# Altium schematic sheet eDP.SchDoc
size A4; SheetNumber: 3; SheetTotal: 9
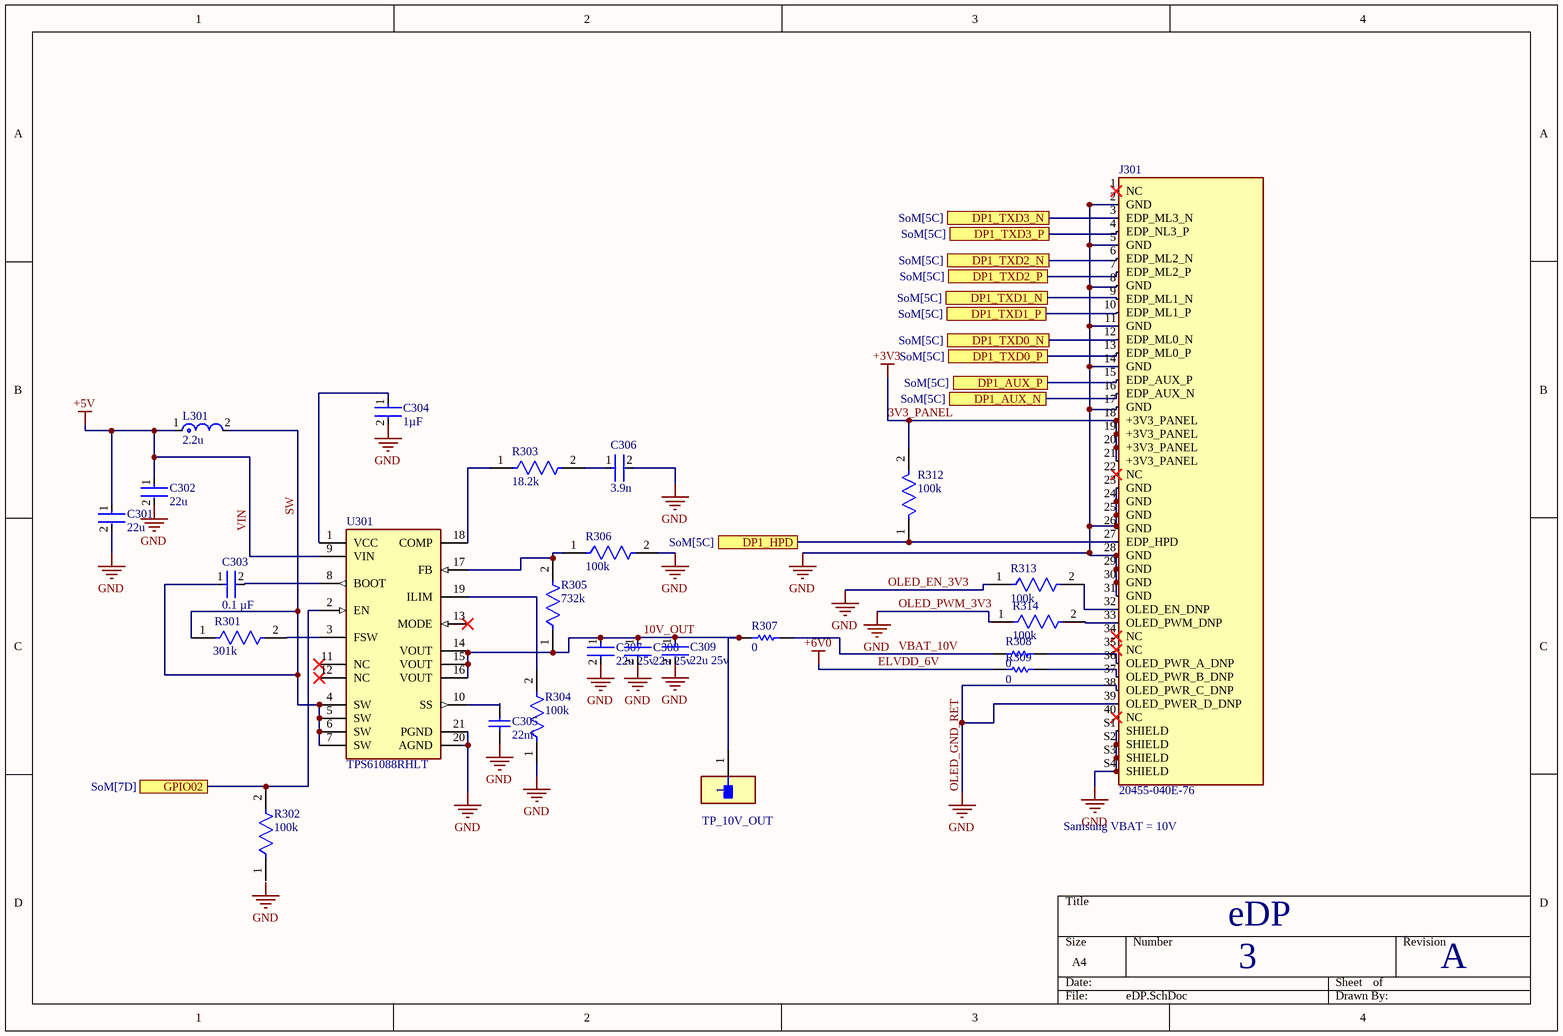
[diagram p0: eDP.SchDoc]

## Parts
C301  22u  [FP-CL10-IPC_B]
C302  22u  [FP-CL10-IPC_B]
C303  0.1 µF  [FP-GRM155-0_05-IPC_B]
C304  1µF  [FP-GRM15-0_1-MFG]
C305  22nf  [CAPC1608X90X35ML10T15]
C306  3.9n  [FP-GRM188-0_1-e0_2_0_5-IPC_B]
C307  22u 25v  [FP-GRM21B-0_2-e0_2_0_7-IPC_B]
C308  22u 25v  [FP-GRM21B-0_2-e0_2_0_7-IPC_B]
C309  22u 25v  [FP-GRM21B-0_2-e0_2_0_7-IPC_B]
J300  TP_10V_OUT  [FP-S2751-46R-MFG]
J301  20455-040E-76  [IPEX_20455-040E-76]
L301  2.2u  [FP-XAL5030-222MEC-MFG]
R301  301k  [FP-CRCW0603-e3-IPC_C]
R302  100k  [FP-CRCW0603C-e3-MFG]
R303  18.2k  [FP-CRCW0603-e3-IPC_C]
R304  100k  [FP-CRCW0603C-e3-MFG]
R305  732k  [FP-CRCW0603-e3-IPC_B]
R306  100k  [FP-CRCW0603C-e3-MFG]
R307  0  [RESC1005X40X25NL05T10]
R308  0  [RESC1005X40X25NL05T10]
R309  0  [RESC1005X40X25NL05T10]
R312  100k  [FP-RC0402-0_4-IPC_A]
R313  100k  [FP-CRCW0603C-e3-MFG]
R314  100k  [FP-CRCW0603C-e3-MFG]
U301  TPS61088RHLT  [FP-RHL0020A-MFG]

## Ports
DP1_AUX_N (see SoM[5C]), DP1_AUX_P (see SoM[5C]), DP1_HPD (see SoM[5C]), DP1_TXD0_N (see SoM[5C]), DP1_TXD0_P (see SoM[5C]), DP1_TXD1_N (see SoM[5C]), DP1_TXD1_P (see SoM[5C]), DP1_TXD2_N (see SoM[5C]), DP1_TXD2_P (see SoM[5C]), DP1_TXD3_N (see SoM[5C]), DP1_TXD3_P (see SoM[5C]), GPIO02 (see SoM[7D])

## Nets
3V3_PANEL: J301.18(+3V3_PANEL) J301.19(+3V3_PANEL) J301.20(+3V3_PANEL) J301.21(+3V3_PANEL) R312.2  [also labelled +3V3]
ELVDD_6V: R309.1  [also labelled +6V0]
OLED_EN_3V3: C301.2 C302.2 C304.2 C305.1 C306.2 C307.2 C308.2 C309.2 J301.2(GND) J301.5(GND) J301.8(GND) J301.11(GND) J301.14(GND) J301.17(GND) J301.23(GND) J301.24(GND) J301.25(GND) J301.26(GND) J301.28(GND) J301.29(GND) J301.30(GND) J301.31(GND) J301.38(OLED_PWR_C_DNP) J301.39(OLED_PWER_D_DNP) J301.S1(SHIELD) J301.S2(SHIELD) J301.S3(SHIELD) J301.S4(SHIELD) R304.1 R306.2 R313.1 R314.1 U301.20(AGND) U301.21(PGND)  [also labelled GND, OLED_GND_RET, OLED_PWM_3V3]
VIN: C301.1 C302.1 L301.1 U301.9(VIN)  [also labelled +5V]
10V_OUT: C307.1 C308.1 C309.1 J300.1 R305.1 R307.1 U301.14(VOUT) U301.15(VOUT) U301.16(VOUT)
DP1_AUX_N: J301.16(EDP_AUX_N) ; port DP1_AUX_N
DP1_AUX_P: J301.15(EDP_AUX_P) ; port DP1_AUX_P
DP1_HPD: J301.27(EDP_HPD) R312.1 ; port DP1_HPD
DP1_TXD0_N: J301.12(EDP_ML0_N) ; port DP1_TXD0_N
DP1_TXD0_P: J301.13(EDP_ML0_P) ; port DP1_TXD0_P
DP1_TXD1_N: J301.9(EDP_ML1_N) ; port DP1_TXD1_N
DP1_TXD1_P: J301.10(EDP_ML1_P) ; port DP1_TXD1_P
DP1_TXD2_N: J301.6(EDP_ML2_N) ; port DP1_TXD2_N
DP1_TXD2_P: J301.7(EDP_ML2_P) ; port DP1_TXD2_P
DP1_TXD3_N: J301.3(EDP_ML3_N) ; port DP1_TXD3_N
DP1_TXD3_P: J301.4(EDP_NL3_P) ; port DP1_TXD3_P
GPIO02: R302.2 U301.2(EN) ; port GPIO02
SW: C303.1 L301.2 R301.1 U301.4(SW) U301.5(SW) U301.6(SW) U301.7(SW)
VBAT_10V: R307.2 R308.1
NetC303_2: C303.2 U301.8(BOOT)
NetC304_1: C304.1 U301.1(VCC)
NetC305_2: C305.2 U301.10(SS)
NetC306_1: C306.1 R303.2
NetJ301_32: J301.32(OLED_EN_DNP) R313.2
NetJ301_33: J301.33(OLED_PWM_DNP) R314.2
NetJ301_36: J301.36(OLED_PWR_A_DNP) R308.2
NetJ301_37: J301.37(OLED_PWR_B_DNP) R309.2
NetR301_2: R301.2 U301.3(FSW)
NetR303_1: R303.1 U301.18(COMP)
NetR304_2: R304.2 U301.19(ILIM)
NetR305_2: R305.2 R306.1 U301.17(FB)

Not connected (* = marked no-connect by the designer): J301 1(NC)* 22(NC)* 34(NC)* 35(NC)* 40(NC)*; R302 1; U301 11(NC)* 12(NC)* 13(MODE)*

## Notes on the sheet
- (near J301) Samsung VBAT = 10V
- eDP
- 3
- A
- Labels drawn without touching a wire or pin: GND

## Library data of the parts
C301 C302 = CMP-13271-002755-1: Cap Ceramic 22uF 16V X5R ±20% Pad SMD 0603 +85°C T/R; Mount: Surface Mount; Packaging: Tape and Reel; Case Code (Imperial): 0603; Max Operating Temperature: 85°C; Capacitance: 22uF; Case/Package: 0603; Voltage Rating: 16V; Tolerance: 20%; Case Code (Metric): 1608; Min Operating Temperature: -55°C
C303 = CMP-06035-003750-1: Chip Multilayer Ceramic Capacitors for General Purpose, 0402, 0.10uF, X7R, 15%, 10%, 50V; Capacitance: 100nF; Weight: 0.000212oz; Package Quantity: 50000; Resistor Type: Ceramic; Mount: Surface Mount; Width: 0.5mm; Case Code (Imperial): 0402; Termination: SMD/SMT; Case/Package: 0402; Voltage Rating: 50V; Height: 0.5mm; Length: 0.039inch; Dielectric: X7R; Case Code (Metric): 1005; Min Operating Temperature: -55°C; Thickness: 0.022inch; Tolerance: 10%; Lead Free: Lead Free; Packaging: Tape and Reel; Max Operating Temperature: 125°C; Voltage Rating (DC): 50V
C304 = CMP-2008-04556-2: CAP CER 1UF 10V X5R 0402; Manufacturer Part Number: GRM155R61A105KE15D; Manufacturer: Murata; Material: Ceramic; Tolerance: 10%; Temperature Coefficient: 15%; Octopart: https://octopart.com/grm155r61a105ke15d-murata-197442; Lead Free: Yes; ComponentLink2Description: Datasheet; Temperature: -55°C to +85°C; Temperature Range High: +85°C; Height: 0.55mm; Capacitance: 1uF; Ipc Land Pattern Name: CAPC10050X50; ComponentLink2URL: https://search.murata.co.jp/Ceramy/image/img/A01X/G101/ENG/GRM155R61A105KE15-01A.pdf; Temperature Range Low: -55°C; Device Class L2: Capacitors; Voltage Rating: 10V; RoHS: TRUE; Device Class L1: Passive Components; Device Class L3: Ceramic Capacitors; Temperature Characteristic: X5R; Mouser Description: 0402 1 uF 10 V ±10% Tolerance X5R Surface Mount Multilayer Ceramic Capacitor; Automotive: No; Package: GRM15-0.1; Digikey Description: CAP CER 1UF 10V X5R 0402; Value: 1uF; Category: Cap
C305 = CMP-2006-02910-1: Manufacturer: Murata; Part Number: GRM188R71H223KA01D
C306 = CMP-06035-027218-1: Chip Multilayer Ceramic Capacitors for General Purpose, 0603, 3900pF, C0G, 30ppm/°C, 5%, 50V; Capacitance: 3.9nF; Voltage: 50V; Case Code (Metric): 1608; Min Operating Temperature: -55°C; Weight: 0.000222oz; Packaging: Tape and Reel; Case/Package: 0603; Package Quantity: 10000; Tolerance: 5%; Width: 0.8mm; Mount: Surface Mount; Length: 0.063inch; Termination: SMD/SMT; Voltage Rating (DC): 50V; Thickness: 0.035inch; Max Operating Temperature: 125°C; Height: 0.8mm; Dielectric: C0G; Voltage Rating: 50V; Case Code (Imperial): 0603
C307-C309 = CMP-2007-03222-3: Chip Multilayer Ceramic Capacitors for General Purpose, 0805, 22uF, X5R, 15%, 20%, 25V; Case/Package: 0805; Depth: 1.25mm; Resistor Type: Ceramic; Voltage Rating: 25V; Lead Free: Lead Free; Voltage Rating (DC): 25V; Case Code (Metric): 2012; Thickness: 0.057inch; REACH SVHC: No SVHC; Material: Ceramic; Tolerance: 20%; Length: 2mm; Capacitance: 22uF; Case Code (Imperial): 0805; Max Operating Temperature: 85°C; Termination: SMD/SMT; Weight: 0.000335oz; Dielectric: X5R; Packaging: Tape and Reel; Voltage: 25V; Package Quantity: 3000; Height: 1.25mm; Mount: Surface Mount; Width: 1.25mm; Min Operating Temperature: -55°C
J300 = CMP-15817-000010-1: 10V nominal; Plating: Tin; Body Material: Brass; Color: Natural; Material: Copper Alloy; Mount: Surface Mount; Packaging: Cut Tape
J301 = CMP-002-00071-3: Conn Wire to Board RCP 40 POS 0.5mm Solder RA Side Entry SMDCABLINE® T/R; Pins: 40; Contact Gender: Female
L301 = CMP-11268-000158-1: Fixed Inductors 2.2uH Shld 20% 9.2A 14.5mOhms AECQ2 SRF: 38MHz Test Freq: 1MHz; Test Frequency: 100kHz; Core Material: Composite; Shielding: Shielded; DC Resistance (DCR): 14.5mR; RMS Current (Irms): 9.7A; Max Operating Temperature: 125°C; Self Resonant Frequency: 38MHz; Package Quantity: 400; Min Operating Temperature: -40°C; Width: 5.48mm; Series: XAL5030; Inductance: 2.2uH; Length: 5.68mm; RoHS Compliant: Yes; Termination: SMD/SMT; Packaging: Tape and Reel; Max DC Current: 9.2A; Saturation Current: 9.2A; Lead Free: Contains Lead; Mount: Surface Mount; Case/Package: SMD/SMT; Height: 3.1mm; Inductance Tolerance: 20%; Tolerance: 20%
R301 = CMP-2000-03218-2: RES Thick Film, 301kΩ, 1%, 0.1W, 100ppm/°C, 0603; Voltage Rating: 75V; Max Power Dissipation: 100mW; Resistance: 301kR; Case Code (Metric): 1608; Weight: 7.1E-05oz; Military Standard: Not; Depth: 0.85mm; Temperature Coefficient: 100ppm/°C; Case Code (Imperial): 0603; Termination: SMD/SMT; Tolerance: 1%; Mount: Surface Mount; Case/Package: 0603; Number of Terminations: 2; Working Voltage: 75V; Number of Pins: 2; Max Operating Temperature: 155°C; Voltage Rating (DC): 75V; Height: 0.45mm; Length: 1.55mm; Packaging: Tape and Reel; Contact Plating: Tin; Radiation Hardening: No; Features: Automotive AEC-Q200; Composition: Thick Film; Min Operating Temperature: -55°C; Lead Free: Lead Free; Power Rating: 100mW; Width: 0.033inch; Package Quantity: 10
R302 R304 R306 R313 R314 = CMP-02407-011574-1: RES SMD 100K OHM 1% 1/10W 0603; Temperature Coefficient: 100ppm/°C; Resistance: 100kR; Power Rating: 100mW; Contact Plating: Tin; Length: 1.55mm; Mount: Surface Mount; Min Operating Temperature: -55°C; RoHS Compliant: Yes; Max Operating Temperature: 155°C; Tolerance: 1%; Resistor Type: Thick Film; Termination: Wraparound; Case/Package: Molded; Lead Free: Lead Free
R303 = CMP-2000-02961-2: RES Thick Film, 18.2kΩ, 1%, 0.1W, 100ppm/°C, 0603; Working Voltage: 75V; Resistance: 18.2kR; Max Power Dissipation: 100mW; Temperature Coefficient: 100ppm/°C; Width: 0.85mm; Termination: SMD/SMT; Voltage Rating (DC): 75V; Length: 1.55mm; Max Operating Temperature: 155°C; Radiation Hardening: No; Min Operating Temperature: -55°C; Composition: Thick Film; Contact Plating: Tin; Case Code (Metric): 1608; Tolerance: 1%; Power Rating: 100mW; Case/Package: 0603; Case Code (Imperial): 0603; Weight: 7.1E-05oz; Number of Terminations: 2; Package Quantity: 10; Packaging: Tape and Reel; Lead Free: Lead Free; Military Standard: Not; Voltage Rating: 75V; Height: 0.45mm; Features: Automotive AEC-Q200; Number of Pins: 2; Depth: 0.85mm
R305 = CMP-1012-00834-2: RES Thick Film, 732kΩ, 1%, 0.1W, 100ppm/°C, 0603; Power Rating: 100mW; Resistance: 732kR; Voltage Rating: 75V; Number of Terminations: 2; Temperature Coefficient: 100ppm/°C; Tolerance: 1%; Package Quantity: 10; Case/Package: 0603; Max Power Dissipation: 100mW; Features: Automotive AEC-Q200; Height: 0.02inch; Military Standard: Not; Contact Plating: Tin; Radiation Hardening: No; Case Code (Imperial): 0603; Depth: 0.85mm; Number of Pins: 2; Min Operating Temperature: -55°C; Width: 0.033inch; Weight: 7.1E-05oz; Composition: Thick Film; Packaging: Tape and Reel; Length: 1.55mm; Termination: SMD/SMT; Case Code (Metric): 1608; Max Operating Temperature: 155°C
R307-R309 = CMP-1011-00001-2: Manufacturer: Yageo / Phycomp; Part Number: RC0402JR-070RL
R312 = CMP-2002-07913-2: RES 100K OHM 5% 1/16W 0402; Temperature Coefficient: 100ppm/°C; Max Power Dissipation: 63mW; Resistance: 100kR; Voltage Rating: 50V; Tolerance: 5%; Packaging: Tape and Reel; Termination: SMD/SMT; Case Code (Metric): 1005; Length: 1mm; Power Rating: 63mW; Min Operating Temperature: -55°C; Case/Package: 0402; Construction: Rectangular; Series: RC; Resistance Tolerance: 5%; Height: 0.016inch; Case Code (Imperial): 0402; RoHS Compliant: Yes; Size Code: 0402; Number of Terminations: 2; Features: Moisture Resistant; Width: 0.02inch; Max Operating Temperature: 155°C; Military Standard: Not; Lead Free: Lead Free; Depth: 0.5mm; Package Quantity: 1; Resistor Type: Thick Film
U301 = CMP-04918-000117-1: IC REG BOOST ADJ 10A 20VQFN; Manufacturer: Texas Instruments; Output Voltage: 4.5-12.6V; Max Junction Temp: +125°C; Max Duty Cycle: 90%; Output Type: AdjustableProgrammable; Nominal Supply Current: 1-110uA; Min Supply Voltage: 2.7V; Switching Frequency: 200-2200kHz; Number Of Outputs: 1; Max Supply Voltage: 12V; Manufacturer Part Number: TPS61088RHLT; Digikey Description: IC REG BOOST ADJ 10A 20VQFN; Octopart: https://octopart.com/tps61088rhlt-texas+instruments-57155059; Switching Topology: Boost; Lead Free: Yes; Output Current: 10A; Height: 1mm; Temperature: -40°C to +85°C; Package: RHL0020A; Device Class L3: Voltage Regulators - Switching; RoHS: TRUE; Temperature Range Low: -40°C; Temperature Range High: +85°C; Device Class L1: Integrated Circuits (ICs); Automotive: No; Category: IC; ComponentLink2Description: Datasheet; ComponentLink2URL: http://www.ti.com/lit/ds/symlink/tps61088.pdf; Device Class L2: Power Management ICs